# EAGLE design Arduino_Board (EAGLE 6.1)

## Sheet 1 of 3
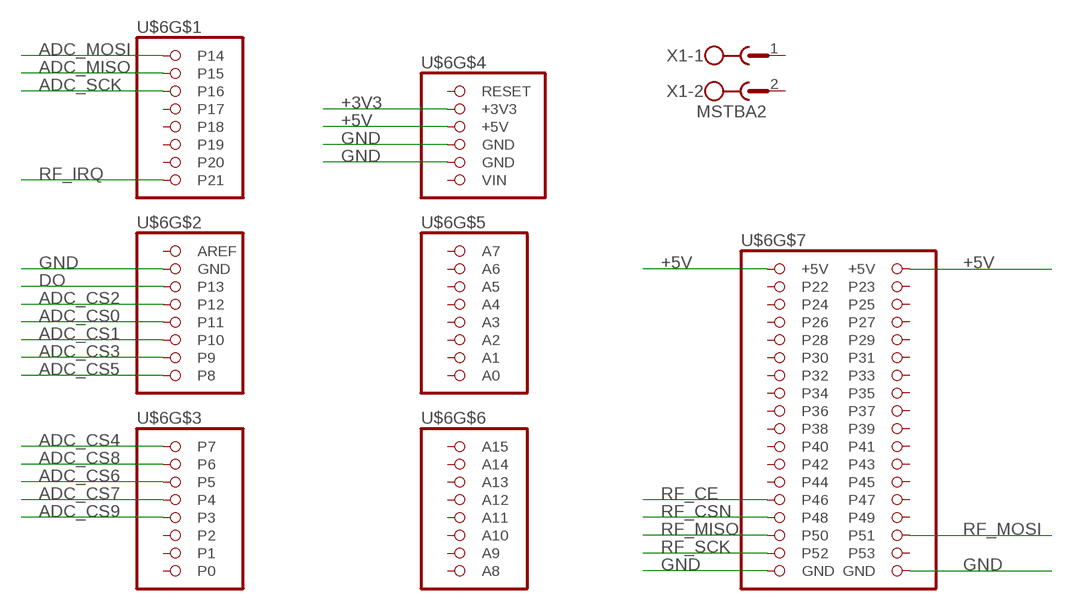
[diagram p0: schematic, sheet 1]

### Parts
U$6  ARDUINO_MEGA  [ARDUINO_MEGA]
X1  MSTBA2  [MSTBA2]

### Nets
+3V3: U$6.+3V3 ; also sheet 3
+5V: U$6.+5V@1(+5V) U$6.+5V@2(+5V) U$6.+5V@3(+5V) ; also sheet 2
ADC_CS0: U$6.P11 ; also sheet 2
ADC_CS1: U$6.P10 ; also sheet 2
ADC_CS2: U$6.P12 ; also sheet 2
ADC_CS3: U$6.P9 ; also sheet 2
ADC_CS4: U$6.P7 ; also sheet 2
ADC_CS5: U$6.P8 ; also sheet 2
ADC_CS6: U$6.P5 ; also sheet 2
ADC_CS7: U$6.P4 ; also sheet 2
ADC_CS8: U$6.P6 ; also sheet 2
ADC_CS9: U$6.P3 ; also sheet 2
ADC_MISO: U$6.P15 ; also sheet 2
ADC_MOSI: U$6.P14 ; also sheet 2
ADC_SCK: U$6.P16 ; also sheet 2
DO: U$6.P13 ; also sheet 2
GND: U$6.GND@1(GND) U$6.GND@2(GND) U$6.GND@3(GND) U$6.GND@4(GND) U$6.GND@5(GND) ; also sheet 2,3
RF_CE: U$6.P46 ; also sheet 3
RF_CSN: U$6.P48 ; also sheet 3
RF_IRQ: U$6.P21 ; also sheet 3
RF_MISO: U$6.P50 ; also sheet 3
RF_MOSI: U$6.P51 ; also sheet 3
RF_SCK: U$6.P52 ; also sheet 3
Unconnected: U$6.A0 U$6.A1 U$6.A2 U$6.A3 U$6.A4 U$6.A5 U$6.A6 U$6.A7 U$6.A8 U$6.A9 U$6.A10 U$6.A11 U$6.A12 U$6.A13 U$6.A14 U$6.A15 U$6.AREF U$6.P0 U$6.P1 U$6.P2 U$6.P17 U$6.P18 U$6.P19 U$6.P20 U$6.P22 U$6.P23 U$6.P24 U$6.P25 U$6.P26 U$6.P27 U$6.P28 U$6.P29 U$6.P30 U$6.P31 U$6.P32 U$6.P33 U$6.P34 U$6.P35 U$6.P36 U$6.P37 U$6.P38 U$6.P39 U$6.P40 U$6.P41 U$6.P42 U$6.P43 U$6.P44 U$6.P45 U$6.P47 U$6.P49 U$6.P53 U$6.RESET U$6.VIN X1.1 X1.2

## Sheet 2 of 3
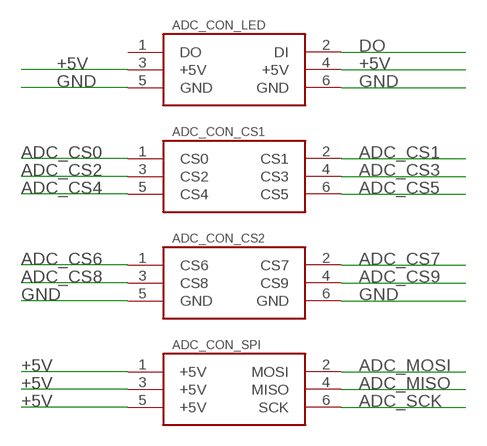
[diagram p1: schematic, sheet 2]

### Parts
U$2  ADC_CON_LED  [T821_2X03]
U$3  ADC_CON_CS1  [T821_2X03]
U$4  ADC_CON_CS2  [T821_2X03]
U$5  ADC_CON_SPI  [T821_2X03]

### Nets
+5V: U$2.3(+5V) U$2.4(+5V) U$5.1(+5V) U$5.3(+5V) U$5.5(+5V) ; also sheet 1
ADC_CS0: U$3.1(CS0) ; also sheet 1
ADC_CS1: U$3.2(CS1) ; also sheet 1
ADC_CS2: U$3.3(CS2) ; also sheet 1
ADC_CS3: U$3.4(CS3) ; also sheet 1
ADC_CS4: U$3.5(CS4) ; also sheet 1
ADC_CS5: U$3.6(CS5) ; also sheet 1
ADC_CS6: U$4.1(CS6) ; also sheet 1
ADC_CS7: U$4.2(CS7) ; also sheet 1
ADC_CS8: U$4.3(CS8) ; also sheet 1
ADC_CS9: U$4.4(CS9) ; also sheet 1
ADC_MISO: U$5.4(MISO) ; also sheet 1
ADC_MOSI: U$5.2(MOSI) ; also sheet 1
ADC_SCK: U$5.6(SCK) ; also sheet 1
DO: U$2.2(DI) ; also sheet 1
GND: U$2.5(GND) U$2.6(GND) U$4.5(GND) U$4.6(GND) ; also sheet 1,3
Unconnected: U$2.1(DO)

## Sheet 3 of 3
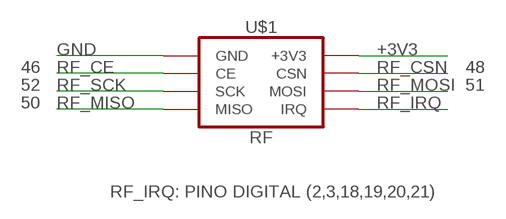
[diagram p2: schematic, sheet 3]

### Parts
U$1  RF  [RF]

### Nets
+3V3: U$1.2(+3V3) ; also sheet 1
GND: U$1.1(GND) ; also sheet 1,2
RF_CE: U$1.3(CE) ; also sheet 1
RF_CSN: U$1.4(CSN) ; also sheet 1
RF_IRQ: U$1.8(IRQ) ; also sheet 1
RF_MISO: U$1.7(MISO) ; also sheet 1
RF_MOSI: U$1.6(MOSI) ; also sheet 1
RF_SCK: U$1.5(SCK) ; also sheet 1

### Notes on the sheet
- 46 | 48
- 52 | 51
- 50
- RF_IRQ: PINO DIGITAL (2,3,18,19,20,21)

## Library data of the parts
U$1 = Arduino_Board:RF
U$2 = Arduino_Board:ADC_CON_LED
U$3 = Arduino_Board:ADC_CON_CS1
U$4 = Arduino_Board:ADC_CON_CS2
U$5 = Arduino_Board:ADC_CON_SPI
U$6 = Arduino_Board:ARDUINO_MEGA
X1 = con-phoenix-508:MSTBA2: PHOENIX; MF: FARNELL; MPN: 1757242; OC_FARNELL: 3705171; OC_NEWARK: 71C4161

## Board
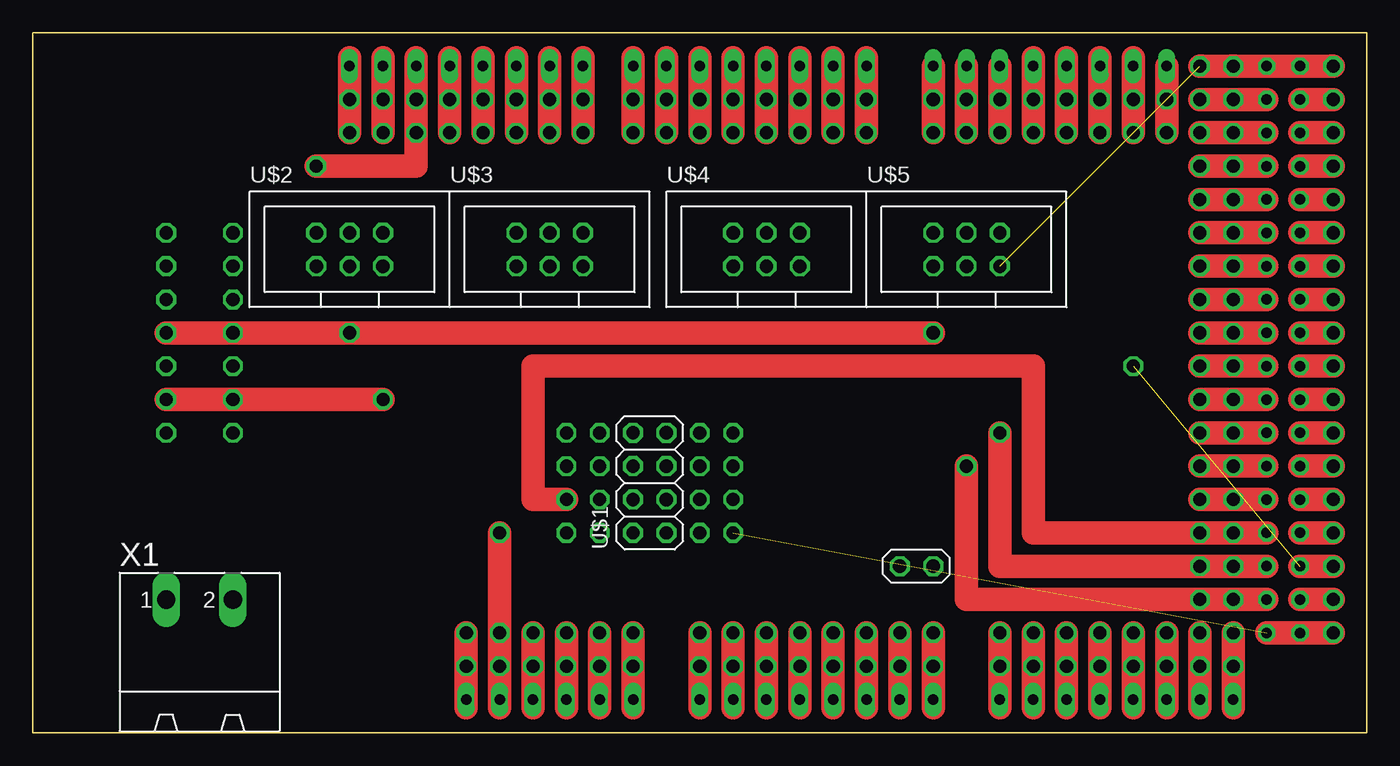
[diagram p3: board, top side]
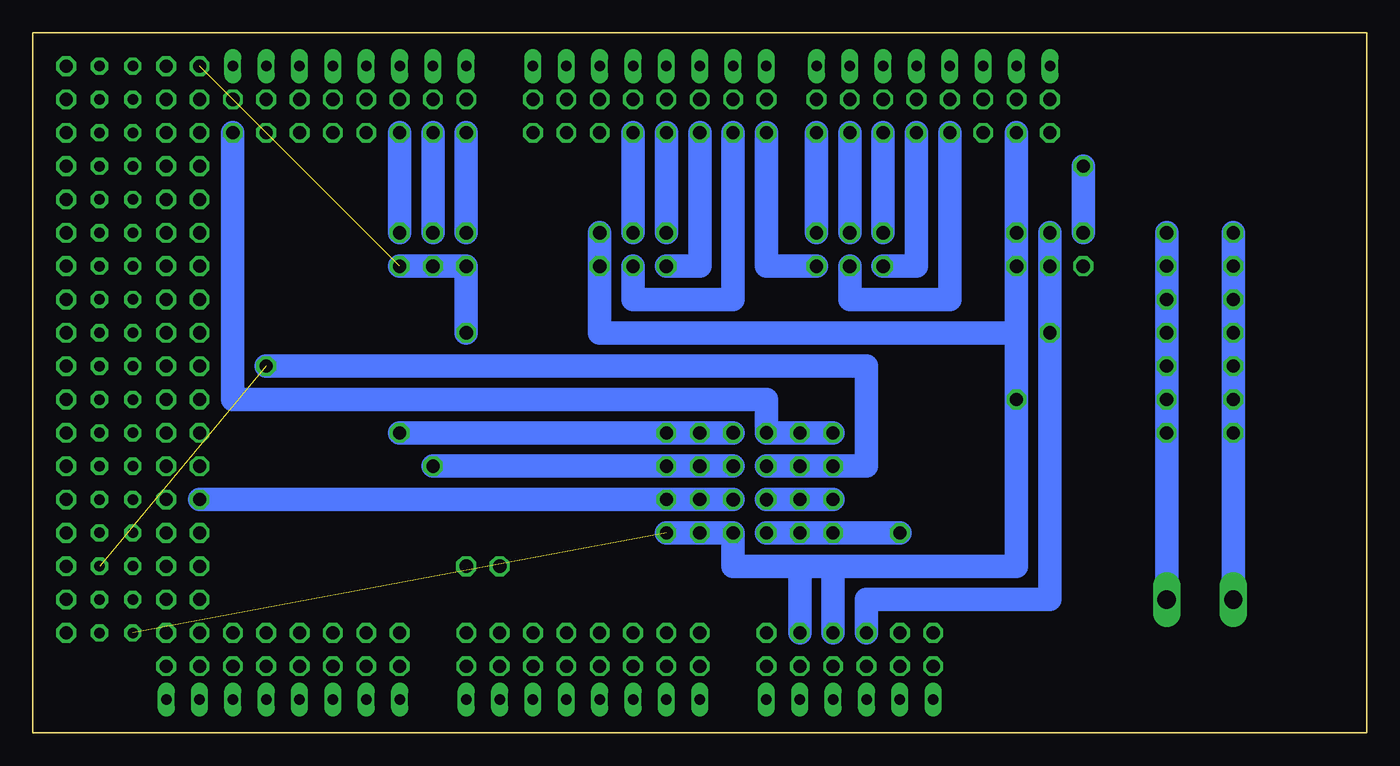
[diagram p4: board, bottom side, seen from below]

Size 101.6 x 53.34 mm. Coordinates in mm from the lower left corner, seen from the top.
Outline: 0,0 101.6,0 101.6,53.34 0,53.34 0,0
Copper layers (1*16): Top 0.035mm / dielectric 1.5mm / Bottom 0.035mm
Design rules: minimum track width 10mil, minimum drill 1mm, track to track 8mil, track to pad 8mil, pad to pad 8mil, via to via 8mil, smd to smd 8mil, copper to edge 40mil, drill to drill 8mil, minimum pad ring 10mil, minimum via ring 8mil, stop-mask expansion 4mil, vias tented up to drill 0mil, thermal gap 10mil

### Footprints (pad centres in the part's own frame; a part is rotated, then mirrored left to right if it is on the bottom)
RF = drill 1.016 octagon: 1 -3.81,-1.27; 2 -3.81,1.27; 3 -1.27,-1.27; 4 -1.27,1.27; 5 1.27,-1.27; 6 1.27,1.27; 7 3.81,-1.27; 8 3.81,1.27; 9 -6.35,-19.05; 10 -6.35,-21.59
T821_2X03 = drill 1.016 octagon: 1 -2.54,-1.27; 2 -2.54,1.27; 3 0,-1.27; 4 0,1.27; 5 2.54,-1.27; 6 2.54,1.27
ARDUINO_MEGA = drill 0.8 long: +3V3 35.56,2.54; +5V@1 38.1,2.54; A0 50.8,2.54; A1 53.34,2.54; A2 55.88,2.54; A3 58.42,2.54; A4 60.96,2.54; A5 63.5,2.54; A6 66.04,2.54; A7 68.58,2.54; A8 73.66,2.54; A9 76.2,2.54; A10 78.74,2.54; A11 81.28,2.54; A12 83.82,2.54; A13 86.36,2.54; A14 88.9,2.54; A15 91.44,2.54; AREF 24.13,50.8; GND@1 26.67,50.8; GND@2 40.64,2.54; GND@3 43.18,2.54; P0 63.5,50.8; P1 60.96,50.8; P2 58.42,50.8; P3 55.88,50.8; P4 53.34,50.8; P5 50.8,50.8; P6 48.26,50.8; P7 45.72,50.8; P8 41.91,50.8; P9 39.37,50.8; P10 36.83,50.8; P11 34.29,50.8; P12 31.75,50.8; P13 29.21,50.8; P14 68.58,50.8; P15 71.12,50.8; P16 73.66,50.8; P17 76.2,50.8; P18 78.74,50.8; P19 81.28,50.8; P20 83.82,50.8; P21 86.36,50.8; RESET 33.02,2.54; VIN 45.72,2.54 | drill 0.8 octagon: +5V@2 93.98,50.8; +5V@3 96.52,50.8; GND@4 93.98,7.62; GND@5 96.52,7.62; P22 93.98,48.26; P23 96.52,48.26; P24 93.98,45.72; P25 96.52,45.72; P26 93.98,43.18; P27 96.52,43.18; P28 93.98,40.64; P29 96.52,40.64; P30 93.98,38.1; P31 96.52,38.1; P32 93.98,35.56; P33 96.52,35.56; P34 93.98,33.02; P35 96.52,33.02; P36 93.98,30.48; P37 96.52,30.48; P38 93.98,27.94; P39 96.52,27.94; P40 93.98,25.4; P41 96.52,25.4; P42 93.98,22.86; P43 96.52,22.86; P44 93.98,20.32; P45 96.52,20.32; P46 93.98,17.78; P47 96.52,17.78; P48 93.98,15.24; P49 96.52,15.24; P50 93.98,12.7; P51 96.52,12.7; P52 93.98,10.16; P53 96.52,10.16
MSTBA2 = drill 1.397 long: 1 -2.54,5.08; 2 2.54,5.08

### Placement (x,y rotation side)
U$1  46.99,19.05 90 top
U$2  24.13,36.83 0 top
U$3  39.37,36.83 0 top
U$4  55.88,36.83 0 top
U$5  71.12,36.83 0 top
U$6  0,0 0 top
X1  12.7,5.08 0 top

### Tracks (layer width: path | path; a pad name or v marks a point on that pad's centre or on a via)
+3V3  (via drill 1)
  Top 1.778: 35.56,1.91 U$6.+3V3 v35.56,5.08 v35.56,7.62 v35.56,15.24
  Bottom 1.778: v35.56,15.24 v40.64,15.24 v43.18,15.24 U$1.2
+5V  (via drill 1)  (1 unrouted)
  Top 1.778: v99.06,50.8 U$6.+5V@3 U$6.+5V@2 v91.44,50.8 v88.9,50.8 | 38.1,1.91 U$6.+5V@1 v38.1,5.08 v38.1,7.62 | v68.58,30.48 v24.13,30.48 10.16,30.48
  Bottom 1.778: U$5.5 U$5.3 U$5.1 v68.58,30.48 | U$2.4 U$2.3 v24.13,30.48 24.13,10.16 38.1,10.16 v38.1,7.62
ADC_CS0  (via drill 1)
  Top 1.778: v34.29,45.72 v34.29,48.26 34.29,51.44 U$6.P11
  Bottom 1.778: U$3.1 34.29,35.56 v34.29,45.72
ADC_CS1  (via drill 1)
  Top 1.778: v36.83,45.72 v36.83,48.26 36.83,51.44 U$6.P10
  Bottom 1.778: U$3.2 v36.83,45.72
ADC_CS2  (via drill 1)
  Top 1.778: v31.75,45.72 v31.75,48.26 31.75,51.44 U$6.P12
  Bottom 1.778: U$3.3 39.37,33.02 31.75,33.02 v31.75,45.72
ADC_CS3  (via drill 1)
  Top 1.778: v39.37,45.72 v39.37,48.26 39.37,51.44 U$6.P9
  Bottom 1.778: U$3.4 v39.37,45.72
ADC_CS4  (via drill 1)
  Top 1.778: v45.72,45.72 v45.72,48.26 45.72,51.44 U$6.P7
  Bottom 1.778: U$3.5 45.72,35.56 v45.72,45.72
ADC_CS5  (via drill 1)
  Top 1.778: v41.91,45.72 v41.91,48.26 41.91,51.44 U$6.P8
  Bottom 1.778: U$3.6 v41.91,45.72
ADC_CS6  (via drill 1)
  Top 1.778: v50.8,45.72 v50.8,48.26 50.8,51.44 U$6.P5
  Bottom 1.778: U$4.1 50.8,35.56 v50.8,45.72
ADC_CS7  (via drill 1)
  Top 1.778: v53.34,45.72 v53.34,48.26 53.34,51.44 U$6.P4
  Bottom 1.778: U$4.2 v53.34,45.72
ADC_CS8  (via drill 1)
  Top 1.778: v48.26,45.72 v48.26,48.26 48.26,51.44 U$6.P6
  Bottom 1.778: U$4.3 55.88,33.02 48.26,33.02 v48.26,45.72
ADC_CS9  (via drill 1)
  Top 1.778: v55.88,45.72 v55.88,48.26 U$6.P3 55.88,51.44
  Bottom 1.778: U$4.4 v55.88,45.72
ADC_MISO  (via drill 1)
  Top 1.778: U$6.P15 v71.12,48.26 v71.12,45.72
  Bottom 1.778: v71.12,45.72 U$5.4
ADC_MOSI  (via drill 1)
  Top 1.778: U$6.P14 v68.58,48.26 v68.58,45.72
  Bottom 1.778: v68.58,45.72 U$5.2
ADC_SCK  (via drill 1)
  Top 1.778: U$6.P16 v73.66,48.26 v73.66,45.72
  Bottom 1.778: v73.66,45.72 U$5.6
DO  (via drill 1)
  Top 1.778: U$6.P13 29.21,51.44 v29.21,48.26 v29.21,45.72 29.21,43.18 27.3,43.18 v21.59,43.18
  Bottom 1.778: U$2.2 v21.59,43.18
GND  (via drill 1)  (1 unrouted)
  Top 1.778: v26.67,45.72 v26.67,48.26 U$6.GND@1 26.67,51.44 | 40.64,1.91 U$6.GND@2 v40.64,5.08 v40.64,7.62 | v43.18,7.62 v43.18,5.08 U$6.GND@3 43.18,1.91 | U$6.GND@5 U$6.GND@4 v99.06,7.62
  Bottom 1.778: v26.67,45.72 U$2.6 U$2.5 26.67,30.48 | U$4.5 U$4.6 58.42,30.48 26.67,30.48 | v53.34,15.24 v50.8,15.24 U$1.1 48.26,12.7 43.18,12.7 | 26.67,30.48 v26.67,25.4 26.67,12.7 40.64,12.7 | 40.64,12.7 v40.64,7.62 | 40.64,12.7 43.18,12.7 | 43.18,12.7 v43.18,7.62
N$1  (via drill 1)
  Top 1.778: 24.13,50.8 24.13,51.44 v24.13,48.26 v24.13,45.72
N$2  (via drill 1)
  Top 1.778: v58.42,45.72 v58.42,48.26 58.42,51.44
N$3  (via drill 1)
  Top 1.778: v60.96,45.72 v60.96,48.26 60.96,51.44
N$4  (via drill 1)
  Top 1.778: v63.5,45.72 v63.5,48.26 63.5,51.44
N$5  (via drill 1)
  Top 1.778: v76.2,45.72 v76.2,48.26 76.2,51.44
N$6  (via drill 1)
  Top 1.778: v78.74,45.72 v78.74,48.26 78.74,51.44
N$7  (via drill 1)
  Top 1.778: v81.28,45.72 v81.28,48.26 81.28,51.44
N$8  (via drill 1)
  Top 1.778: 83.82,45.72 v83.82,48.26 83.82,51.44
N$10  (via drill 1)
  other vias: 83.82,45.72
N$11  (via drill 1)
  Top 1.778: v33.02,7.62 v33.02,5.08 33.02,1.91
N$12  (via drill 1)
  Top 1.778: v45.72,7.62 v45.72,5.08 45.72,1.91
N$13  (via drill 1)
  Top 1.778: v50.8,7.62 v50.8,5.08 50.8,1.91
N$14  (via drill 1)
  Top 1.778: v53.34,7.62 v53.34,5.08 53.34,1.91
N$15  (via drill 1)
  Top 1.778: v55.88,7.62 v55.88,5.08 55.88,1.91
N$16  (via drill 1)
  Top 1.778: v58.42,7.62 v58.42,5.08 58.42,1.91
N$17  (via drill 1)
  Top 1.778: v60.96,7.62 v60.96,5.08 60.96,1.91
N$18  (via drill 1)
  Top 1.778: v63.5,7.62 v63.5,5.08 63.5,1.91
N$19  (via drill 1)
  Top 1.778: v66.04,7.62 v66.04,5.08 66.04,1.91
N$20  (via drill 1)
  Top 1.778: v68.58,7.62 v68.58,5.08 68.58,1.91
N$21  (via drill 1)
  Top 1.778: v73.66,7.62 v73.66,5.08 73.66,1.91
N$22  (via drill 1)
  Top 1.778: v76.2,7.62 v76.2,5.08 76.2,1.91
N$23  (via drill 1)
  Top 1.778: v78.74,7.62 v78.74,5.08 78.74,1.91
N$24  (via drill 1)
  Top 1.778: v81.28,7.62 v81.28,5.08 81.28,1.91
N$25  (via drill 1)
  Top 1.778: v83.82,7.62 v83.82,5.08 83.82,1.91
N$26  (via drill 1)
  Top 1.778: v86.36,7.62 v86.36,5.08 86.36,1.91
N$27  (via drill 1)
  Top 1.778: v88.9,7.62 v88.9,5.08 88.9,1.91
N$28  (via drill 1)
  Top 1.778: v91.44,7.62 v91.44,5.08 91.44,1.91
N$29  (via drill 1)
  Top 1.778: v99.06,48.26 96.52,48.26
N$30  (via drill 1)
  Top 1.778: v99.06,45.72 96.52,45.72
N$31  (via drill 1)
  Top 1.778: v99.06,43.18 96.52,43.18
N$32  (via drill 1)
  Top 1.778: v99.06,40.64 96.52,40.64
N$33  (via drill 1)
  Top 1.778: v88.9,48.26 v91.44,48.26 93.98,48.26
N$34  (via drill 1)
  Top 1.778: v88.9,45.72 v91.44,45.72 93.98,45.72
N$35  (via drill 1)
  Top 1.778: v88.9,43.18 v91.44,43.18 93.98,43.18
N$36  (via drill 1)
  Top 1.778: v88.9,40.64 v91.44,40.64 93.98,40.64
N$37  (via drill 1)
  Top 1.778: v88.9,38.1 v91.44,38.1 93.98,38.1
N$38  (via drill 1)
  Top 1.778: v99.06,38.1 96.52,38.1
N$39  (via drill 1)
  Top 1.778: v88.9,35.56 v91.44,35.56 93.98,35.56
N$40  (via drill 1)
  Top 1.778: 96.52,35.56 v99.06,35.56
N$41  (via drill 1)
  Top 1.778: v88.9,33.02 v91.44,33.02 93.98,33.02
N$42  (via drill 1)
  Top 1.778: 96.52,33.02 v99.06,33.02
N$43  (via drill 1)
  Top 1.778: v99.06,30.48 96.52,30.48
N$44  (via drill 1)
  Top 1.778: v88.9,30.48 v91.44,30.48 93.98,30.48
N$45  (via drill 1)
  Top 1.778: v88.9,27.94 v91.44,27.94 93.98,27.94
N$46  (via drill 1)
  Top 1.778: 96.52,27.94 v99.06,27.94
N$47  (via drill 1)
  Top 1.778: v88.9,25.4 v91.44,25.4 93.98,25.4
N$48  (via drill 1)
  Top 1.778: 96.52,25.4 v99.06,25.4
N$49  (via drill 1)
  Top 1.778: v99.06,22.86 96.52,22.86
N$50  (via drill 1)
  Top 1.778: 93.98,22.86 v91.44,22.86 v88.9,22.86
N$51  (via drill 1)
  Top 1.778: v88.9,20.32 v91.44,20.32 93.98,20.32
N$52  (via drill 1)
  Top 1.778: 96.52,20.32 v99.06,20.32
N$53  (via drill 1)
  Top 1.778: v99.06,17.78 96.52,17.78
N$54  (via drill 1)
  Top 1.778: v99.06,15.24 96.52,15.24
N$55  (via drill 1)
  Top 1.778: v99.06,10.16 96.52,10.16
N$56  (via drill 1)
  Bottom 1.778: 10.16,10.16 v10.16,22.86 v10.16,27.94 v10.16,33.02 v10.16,35.56 v10.16,38.1
N$57  (via drill 1)
  Bottom 1.778: 15.24,10.16 v15.24,22.86 v15.24,27.94 v15.24,33.02 v15.24,35.56 v15.24,38.1
N$58  (via drill 1)
  other vias: 10.16,30.48
N$59  (via drill 1)
  other vias: 15.24,30.48
N$60  (via drill 1)
  other vias: 10.16,25.4
N$61  (via drill 1)
  other vias: 15.24,25.4
N$62
  Top 1.778: 10.16,25.4 26.67,25.4
RF_CE  (via drill 1)
  Top 1.778: U$6.P46 v91.44,17.78 v88.9,17.78
  Bottom 1.778: U$1.3 v50.8,17.78 v53.34,17.78 v88.9,17.78
RF_CSN  (via drill 1)
  Top 1.778: U$6.P48 v91.44,15.24 v88.9,15.24 76.2,15.24 76.2,27.94 38.1,27.94 38.1,17.78 v40.64,17.78
  Bottom 1.778: U$1.4 v40.64,17.78 v43.18,17.78
RF_IRQ  (via drill 1)
  Top 1.778: U$6.P21 v86.36,48.26 v86.36,45.72
  Bottom 1.778: U$1.8 v43.18,22.86 v40.64,22.86 U$1.8 | U$1.8 45.72,25.4 86.36,25.4 v86.36,45.72
RF_MISO  (via drill 1)
  Top 1.778: U$6.P50 v91.44,12.7 v88.9,12.7 73.66,12.7 v73.66,22.86
  Bottom 1.778: v73.66,22.86 v53.34,22.86 v50.8,22.86 U$1.7
RF_MOSI  (via drill 1)  (1 unrouted)
  Top 1.778: U$6.P51 v99.06,12.7
  Bottom 1.778: U$1.6 v43.18,20.32 v40.64,20.32 38.1,20.32 38.1,27.94 v83.82,27.94
RF_SCK  (via drill 1)
  Top 1.778: U$6.P52 v91.44,10.16 v88.9,10.16 71.12,10.16 v71.12,20.32
  Bottom 1.778: v71.12,20.32 v53.34,20.32 v50.8,20.32 U$1.5